# EAGLE design 504_i2c_expand (EAGLE 7.4.0)
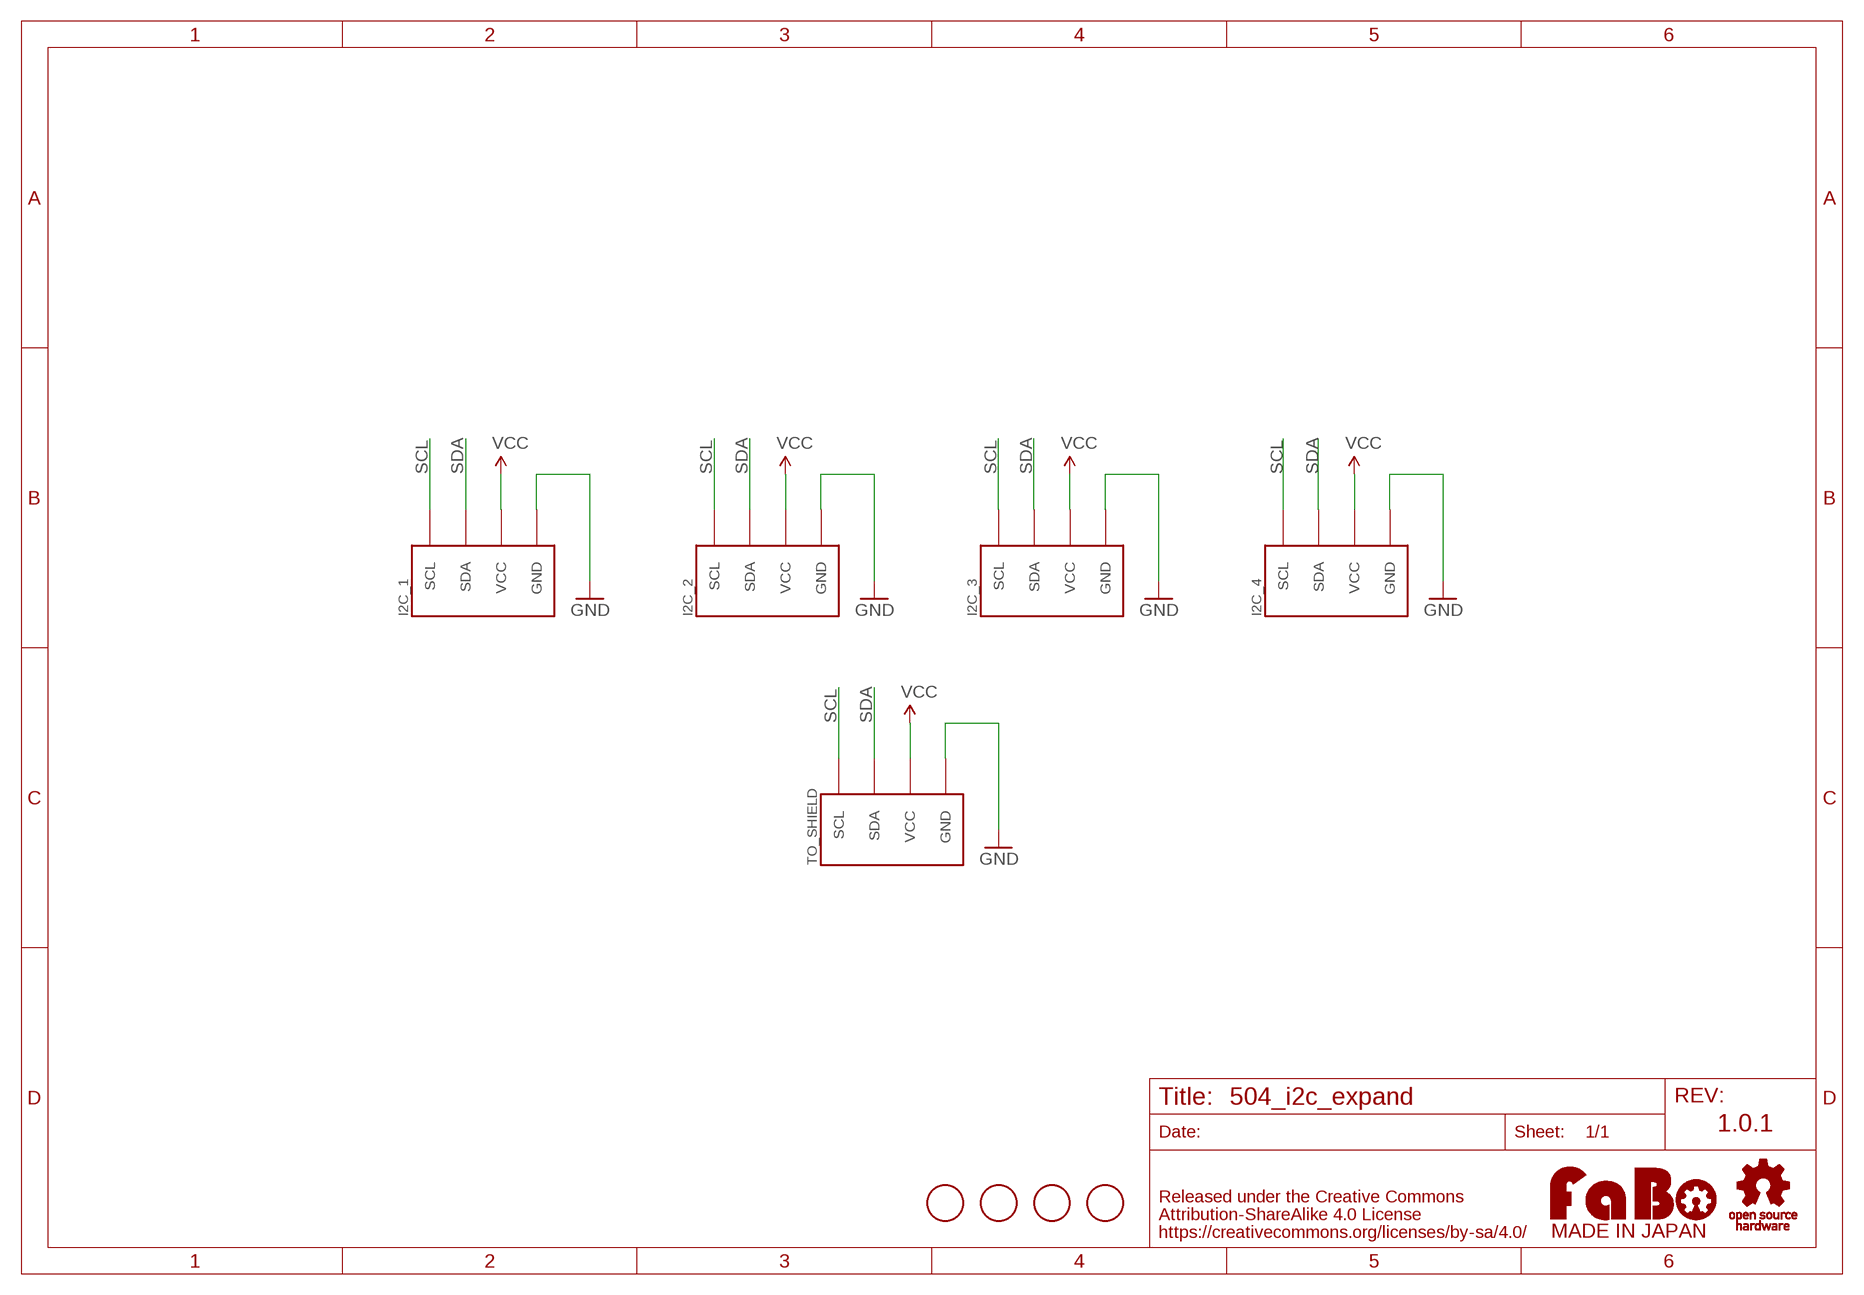
[diagram p0: schematic, sheet 1]

## Parts
I2C_1  FABO_BRICK_I2C-CONNECTOR  [FABO_BRICK_I2C_CONNECTOR]
I2C_2  FABO_BRICK_I2C-CONNECTOR  [FABO_BRICK_I2C_CONNECTOR]
I2C_3  FABO_BRICK_I2C-CONNECTOR  [FABO_BRICK_I2C_CONNECTOR]
I2C_4  FABO_BRICK_I2C-CONNECTOR  [FABO_BRICK_I2C_CONNECTOR]
TO_SHIELD  FABO_BRICK_I2C-CONNECTOR  [FABO_BRICK_I2C_CONNECTOR]
U$7  SCREW-PAD-3MM  [SCREWPAD_3MM]
U$8  SCREW-PAD-3MM  [SCREWPAD_3MM]
U$9  SCREW-PAD-3MM  [SCREWPAD_3MM]
U$10  SCREW-PAD-3MM  [SCREWPAD_3MM]
U$11  LOGO_OSHW-T_M  [LOGO_OSHW_T_MS]
U$12  LOGO_FABO-M  [LOGO_FABO_MS]

## Nets
GND: I2C_1.GND I2C_2.GND I2C_3.GND I2C_4.GND TO_SHIELD.GND
SCL: I2C_1.SCL I2C_2.SCL I2C_3.SCL I2C_4.SCL TO_SHIELD.SCL
SDA: I2C_1.SDA I2C_2.SDA I2C_3.SDA I2C_4.SDA TO_SHIELD.SDA
VCC: I2C_1.VCC I2C_2.VCC I2C_3.VCC I2C_4.VCC TO_SHIELD.VCC

## Notes on the sheet
- 1.0.1

## Library data of the parts
I2C_1-I2C_4 TO_SHIELD = FaBo-Template:FABO_BRICK_I2C: FaBo Brick I2C
U$7-U$10 = gclue:SCREW-PAD
U$11 = FaBo-etc:LOGO_OSHW
U$12 = FaBo-etc:LOGO_FABO

## Board
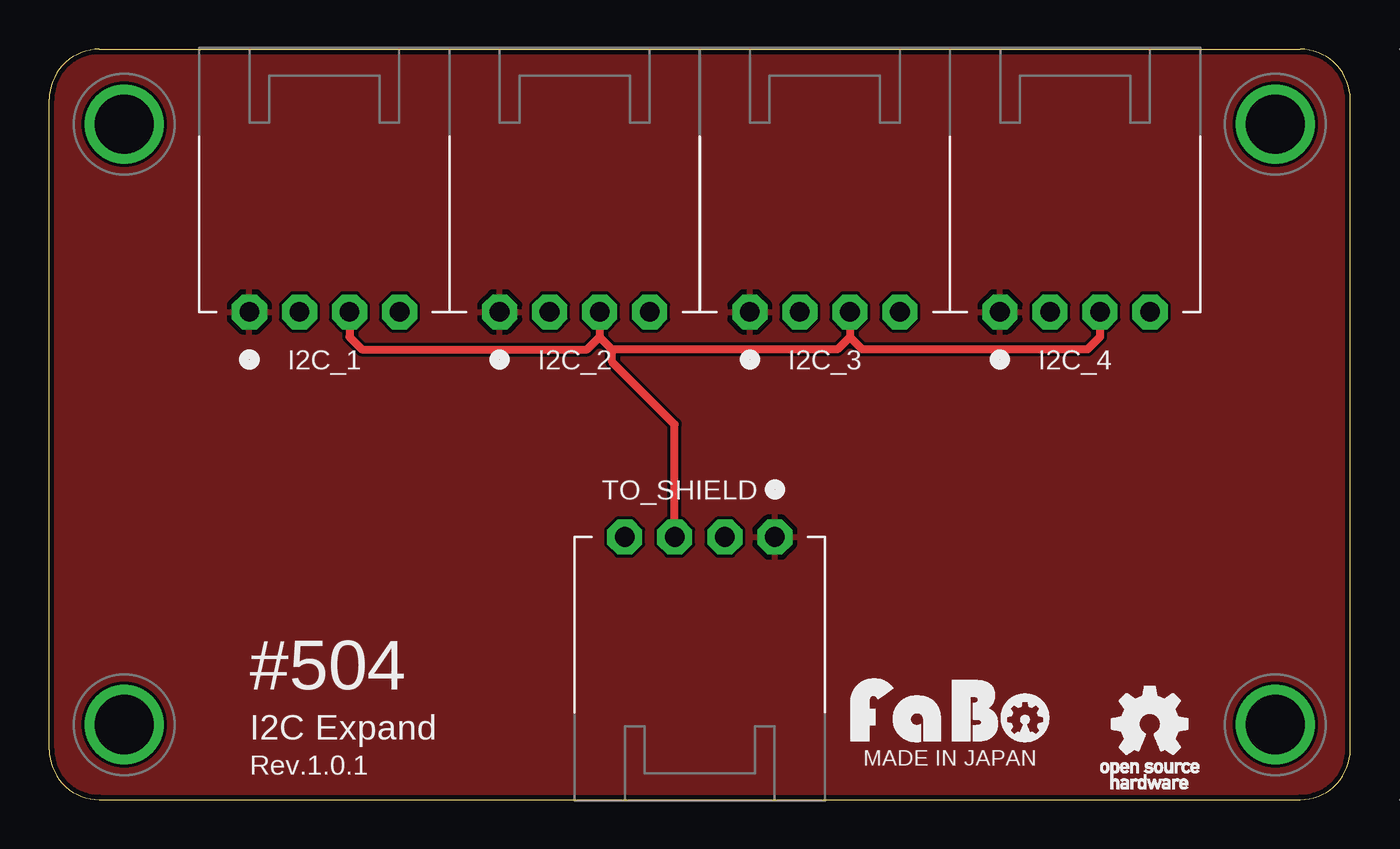
[diagram p1: board, top side]
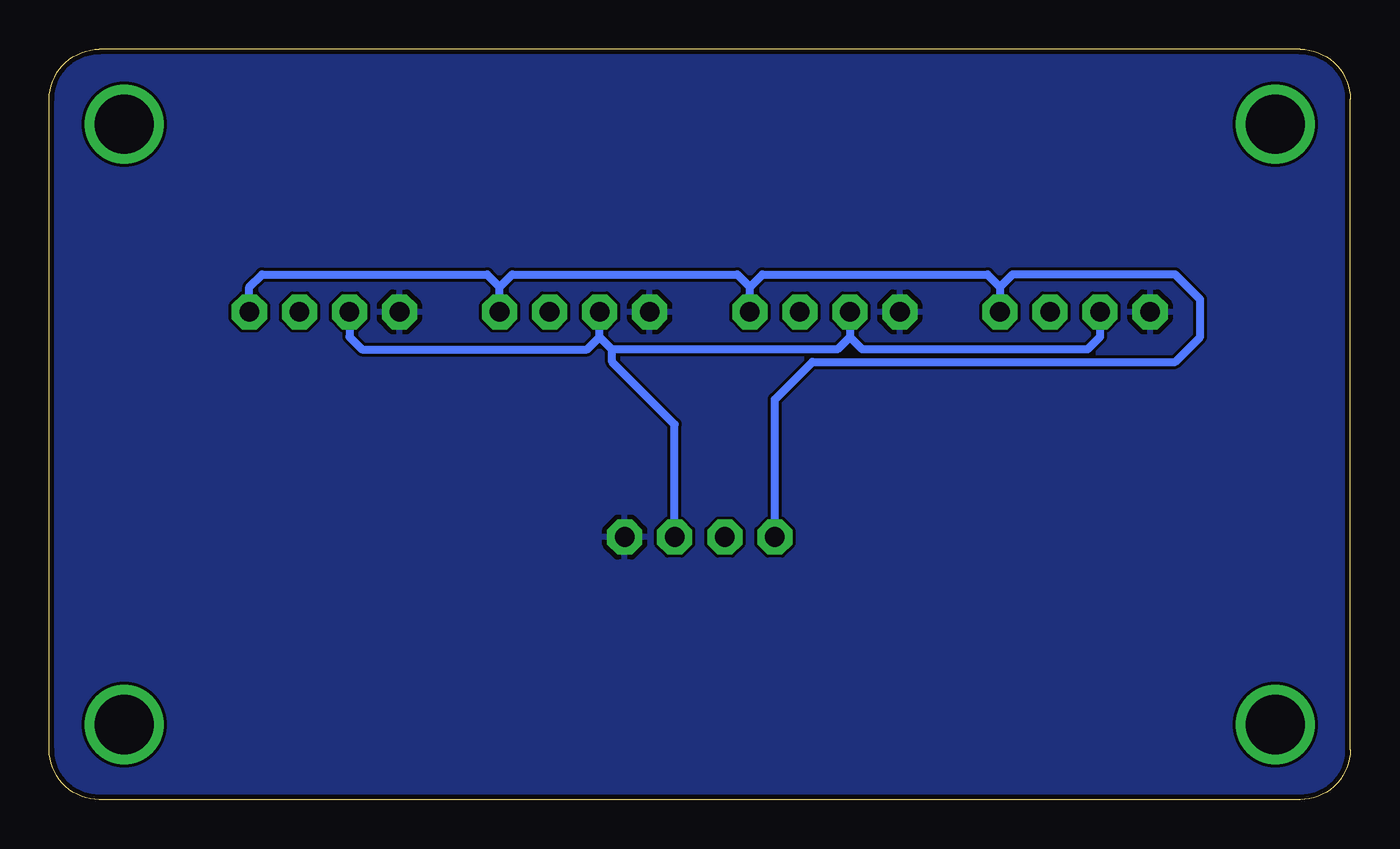
[diagram p2: board, bottom side, seen from below]

Size 66.04 x 38.1 mm. Coordinates in mm from the lower left corner, seen from the top.
Outline: 2.54,0 63.5,0 arc90 66.04,2.54 66.04,35.56 arc90 63.5,38.1 2.54,38.1 arc90 0,35.56 0,2.54 arc90 2.54,0
Copper layers (1*16): Top 0.035mm / dielectric 1.5mm / Bottom 0.035mm
Design rules "Elecrow_2-layer_eagle_rule": minimum track width 6mil, minimum drill 12mil, track to track 6mil, track to pad 6mil, pad to pad 6mil, via to via 6mil, smd to smd 0mil, copper to edge 10mil, drill to drill 10mil, minimum pad ring 10mil, minimum via ring 6mil, stop-mask expansion 2mil, vias tented up to drill 100mil, thermal gap 10mil

### Footprints (pad centres in the part's own frame; a part is rotated, then mirrored left to right if it is on the bottom)
FABO_BRICK_I2C_CONNECTOR = drill 1 pad 1.778 octagon: GND -3.81,0; SCL 3.81,0; SDA 1.27,0; VCC -1.27,0
SCREWPAD_3MM = drill 3 pad 3.81: 1 0,0

### Placement (x,y rotation side)
I2C_1  13.97,24.77 0 top
I2C_2  26.67,24.77 0 top
I2C_3  39.37,24.77 0 top
I2C_4  52.07,24.77 0 top
TO_SHIELD  33.02,13.34 180 top
U$7  3.81,3.81 0 top
U$8  3.81,34.29 0 top
U$9  62.23,34.29 0 top
U$10  62.23,3.81 0 top
U$11  55.88,3.81 0 top
U$12  45.72,2.54 0 top

### Tracks (layer width: path | path; a pad name or v marks a point on that pad's centre or on a via)
GND
  pour Bottom: -1.27,-1.27 67.31,-1.27 67.31,39.37 -1.27,39.37
  pour Top: -1.27,-1.27 67.31,-1.27 67.31,39.37 -1.27,39.37
SCL
  Bottom 0.406: I2C_4.SCL 55.88,26.04 55.24,26.67 43.81,26.67 43.18,26.04 | I2C_3.SCL 43.18,26.04 | 43.18,26.04 42.55,26.67 31.11,26.67 30.48,26.04 | I2C_2.SCL 30.48,26.04 | 30.48,26.04 29.84,26.67 18.41,26.67 17.78,26.04 | 17.78,26.04 I2C_1.SCL | TO_SHIELD.SCL 29.21,20.32 27.3,22.23 8.89,22.23 7.62,23.5 7.62,25.4 8.89,26.67 17.14,26.67 17.78,26.04
SDA
  Top 0.406: I2C_4.SDA 53.34,23.5 52.7,22.86 41.27,22.86 40.64,23.5 | I2C_3.SDA 40.64,23.5 | 40.64,23.5 40.01,22.86 28.57,22.86 | 28.57,22.86 27.94,23.5 | I2C_2.SDA 27.94,23.5 | 27.94,23.5 27.3,22.86 15.88,22.86 15.24,23.5 I2C_1.SDA | TO_SHIELD.SDA 31.75,19.05 28.57,22.23 28.57,22.86
VCC
  Bottom 0.406: I2C_1.VCC 12.7,23.5 13.34,22.86 24.77,22.86 25.4,23.5 | I2C_2.VCC 25.4,23.5 | 25.4,23.5 26.04,22.86 37.47,22.86 | 37.47,22.86 38.1,23.5 | 38.1,23.5 I2C_3.VCC | I2C_4.VCC 50.8,23.5 50.16,22.86 38.73,22.86 38.1,23.5 | TO_SHIELD.VCC 34.29,19.05 37.47,22.23 37.47,22.86

### Text on the board
tPlace: #504 | I2C Expand | MADE IN JAPAN | Rev.1.0.1